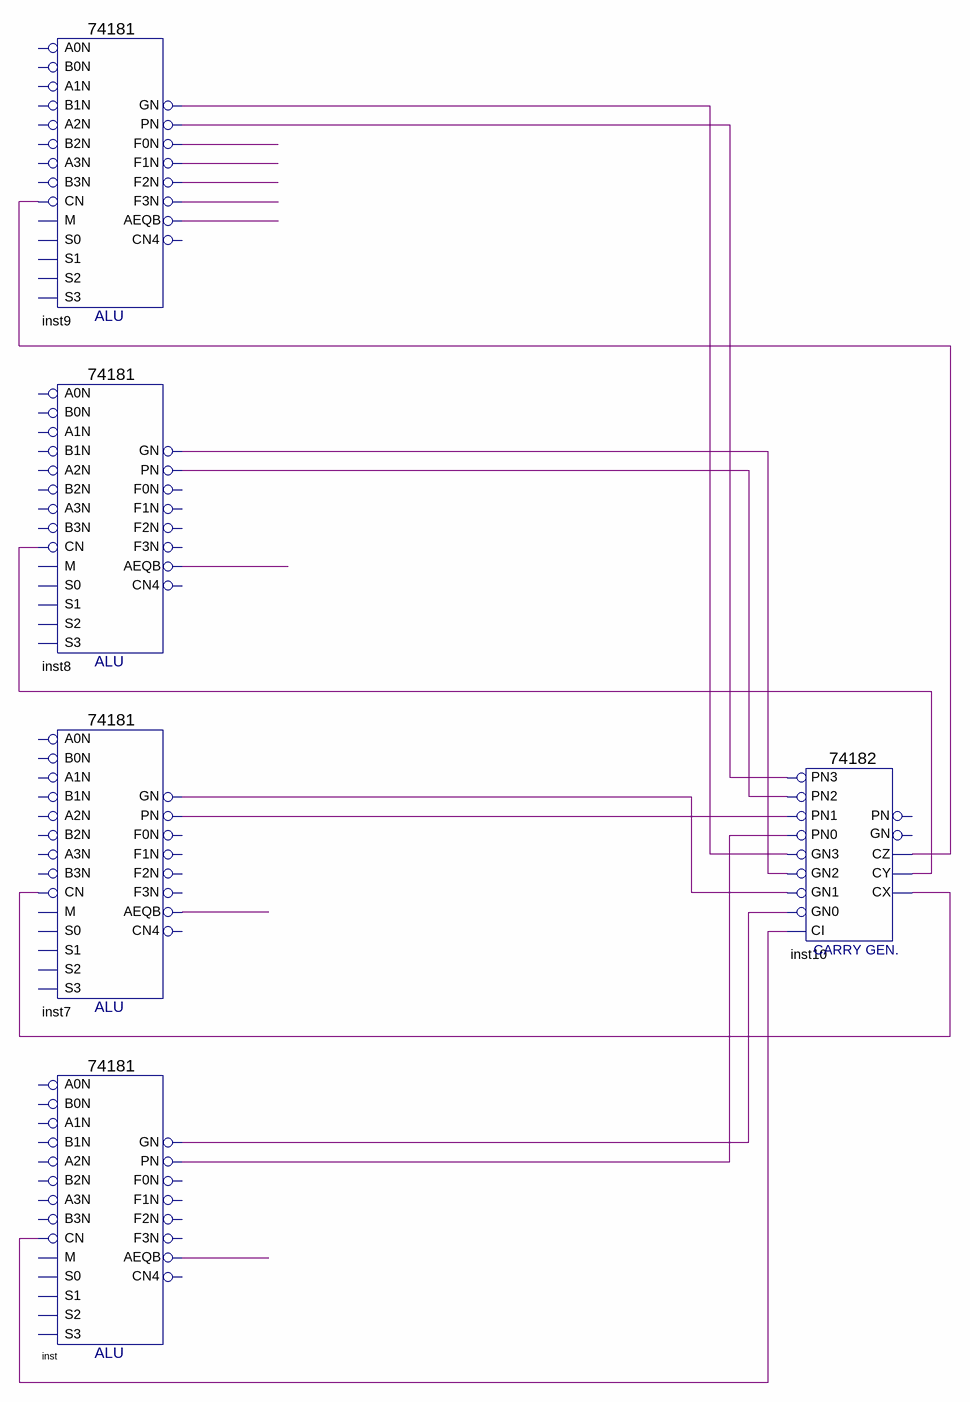
[diagram p0: schematic sheet]
// Quartus schematic ALU16.bdf as structural Verilog: 5 symbols, 0 pins
module ALU16 (
);

  wire inst7_aeqb, inst7_gn, inst7_pn, inst8_aeqb, inst8_gn, inst8_pn, inst9_aeqb, inst9_f0n, inst9_f1n,
       inst9_f2n, inst9_f3n, inst9_gn, inst9_pn, inst10_cx, inst10_cy, inst10_cz, inst_aeqb, inst_gn,
       inst_pn, undriven;

  \74181  inst9 (
    .CN(inst10_cz), .PN(inst9_pn), .GN(inst9_gn), .F3N(inst9_f3n), .F1N(inst9_f1n), .F0N(inst9_f0n),
    .AEQB(inst9_aeqb), .F2N(inst9_f2n));  // open: B0N, A0N, A1N, B1N, A3N, B2N, A2N, M, B3N, S2, S1, S0, S3, CN4
  \74181  inst8 (
    .CN(inst10_cy), .PN(inst8_pn), .GN(inst8_gn), .AEQB(inst8_aeqb));  // open: B0N, A0N, A1N, B1N, A3N, B2N, A2N, M, B3N, S2, S1, S0, S3, F3N, F1N, F0N, CN4, F2N
  \74181  inst7 (
    .CN(inst10_cx), .PN(inst7_pn), .GN(inst7_gn), .AEQB(inst7_aeqb));  // open: B0N, A0N, A1N, B1N, A3N, B2N, A2N, M, B3N, S2, S1, S0, S3, F3N, F1N, F0N, CN4, F2N
  \74181  inst (
    .CN(undriven), .PN(inst_pn), .GN(inst_gn), .AEQB(inst_aeqb));  // open: B0N, A0N, A1N, B1N, A3N, B2N, A2N, M, B3N, S2, S1, S0, S3, F3N, F1N, F0N, CN4, F2N
  \74182  inst10 (
    .PN2(inst8_pn), .GN2(inst8_gn), .GN3(inst9_gn), .PN3(inst9_pn), .CI(undriven), .PN1(inst7_pn),
    .PN0(inst_pn), .GN1(inst7_gn), .GN0(inst_gn), .CY(inst10_cy), .CX(inst10_cx), .CZ(inst10_cz));  // open: PN, GN
endmodule
